# Altium schematic sheet MCU.SchDoc
size A3; Organization: Altium Limited; Address1: L3, 12a Rodborough Rd; Address2: Frenchs Forest; Address3: NSW; Address4: Australia 2086; DocumentNumber: 3; SheetNumber: 3; SheetTotal: 5
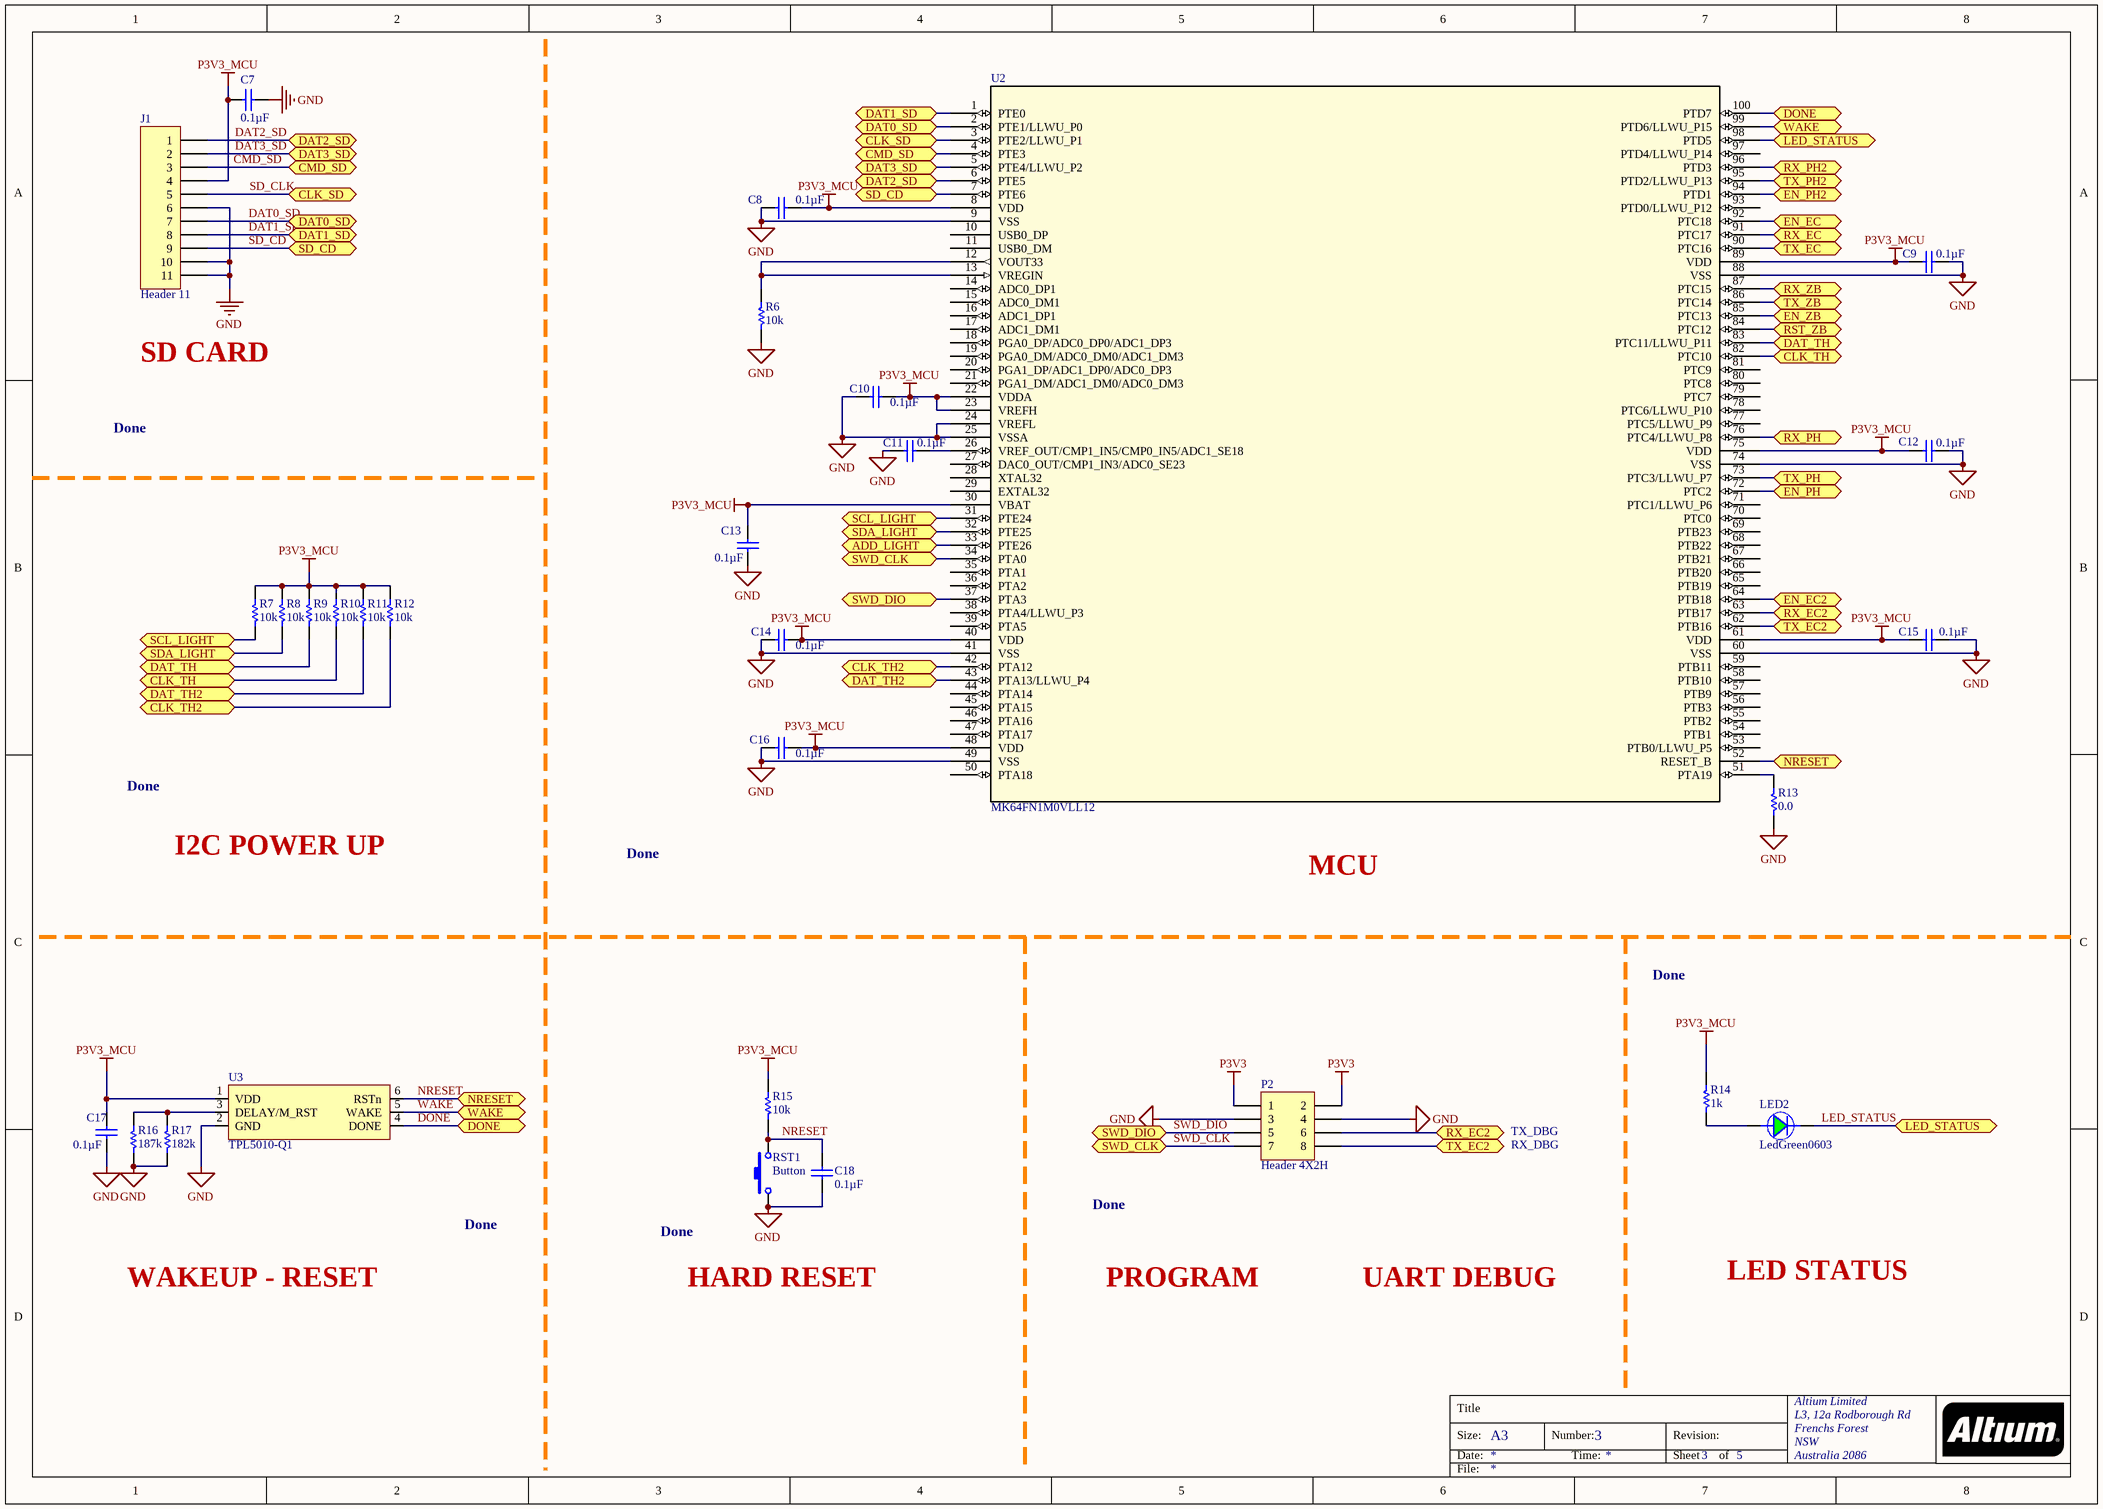
[diagram p0: MCU.SchDoc]

## Parts
C7  0.1µF  [C0402M]
C8  0.1µF  [C0402M]
C9  0.1µF  [C0402M]
C10  0.1µF  [C0402M]
C11  0.1µF  [C0402M]
C12  0.1µF  [C0402M]
C13  0.1µF  [C0402M]
C14  0.1µF  [C0402M]
C15  0.1µF  [C0402M]
C16  0.1µF  [C0402M]
C17  0.1µF  [C0402M]
C18  0.1µF  [C0402M]
J1  Header 11  [TF_V3]
LED2  LedGreen0603  [0603LED-GREEN]
P2  Header 4X2H  [HDR2X4]
R6  10k  [R0603M]
R7  10k  [R0603M]
R8  10k  [R0603M]
R9  10k  [R0603M]
R10  10k  [R0603M]
R11  10k  [R0603M]
R12  10k  [R0603M]
R13  0.0  [R0603M]
R14  1k  [R0603M]
R15  10k  [R0603M]
R16  187k  [R0603M]
R17  182k  [R0603M]
RST1  Button  [SWSMD]
U2  MK64FN1M0VLL12  [LQFP-100_14X14X1]
U3  TPL5010-Q1  [SOT23-6]

## Ports
ADD_LIGHT, CLK_SD, CLK_TH, CLK_TH2, CMD_SD, DAT0_SD, DAT1_SD, DAT2_SD, DAT3_SD, DAT_TH, DAT_TH2, DONE, EN_EC, EN_EC2, EN_PH, EN_PH2, EN_ZB, LED_STATUS, NRESET, RST_ZB, RX_EC, RX_EC2, RX_PH, RX_PH2, RX_ZB, SCL_LIGHT, SD_CD, SDA_LIGHT, SWD_CLK, SWD_DIO, TX_EC, TX_EC2, TX_PH, TX_PH2, TX_ZB, WAKE

## Nets
GND: C7.2 C8.2 C9.2 C10.2 C11.2 C12.2 C13.2 C14.1 C15.2 C16.1 C17.1 C18.1 J1.6 J1.10 J1.11 P2.3 P2.4 R6.1 R13.1 R16.1 R17.1 RST1.1 U2.9(VSS) U2.24(VREFL) U2.25(VSSA) U2.41(VSS) U2.49(VSS) U2.60(VSS) U2.74(VSS) U2.88(VSS) U3.2(GND)
P3V3: P2.1 P2.2
P3V3_MCU: C7.1 C8.1 C9.1 C10.1 C12.1 C13.1 C14.2 C15.1 C16.2 C17.2 J1.4 R7.2 R8.2 R9.2 R10.2 R11.2 R12.2 R14.1 R15.1 U2.8(VDD) U2.22(VDDA) U2.23(VREFH) U2.30(VBAT) U2.40(VDD) U2.48(VDD) U2.61(VDD) U2.75(VDD) U2.89(VDD) U3.1(VDD)
ADD_LIGHT: U2.33(PTE26) ; port ADD_LIGHT
CLK_TH: R10.1 U2.82(PTC10) ; port CLK_TH
CLK_TH2: R12.1 U2.42(PTA12) ; port CLK_TH2
CMD_SD: J1.3 U2.4(PTE3) ; port CMD_SD
DAT0_SD: J1.7 U2.2(PTE1/LLWU_P0) ; port DAT0_SD
DAT1_SD: J1.8 U2.1(PTE0) ; port DAT1_SD
DAT2_SD: J1.1 U2.6(PTE5) ; port DAT2_SD
DAT3_SD: J1.2 U2.5(PTE4/LLWU_P2) ; port DAT3_SD
DAT_TH: R9.1 U2.83(PTC11/LLWU_P11) ; port DAT_TH
DAT_TH2: R11.1 U2.43(PTA13/LLWU_P4) ; port DAT_TH2
DONE: U2.100(PTD7) U3.4(DONE) ; port DONE
EN_EC: U2.92(PTC18) ; port EN_EC
EN_EC2: U2.64(PTB18) ; port EN_EC2
EN_PH: U2.72(PTC2) ; port EN_PH
EN_PH2: U2.94(PTD1) ; port EN_PH2
EN_ZB: U2.85(PTC13) ; port EN_ZB
LED_STATUS: LED2.2(Katot) U2.98(PTD5) ; port LED_STATUS
NRESET: C18.2 R15.2 RST1.2 U2.52(RESET_B) U3.6(RSTn) ; port NRESET
RST_ZB: U2.84(PTC12) ; port RST_ZB
RX_EC: U2.91(PTC17) ; port RX_EC
RX_EC2: P2.6 U2.63(PTB17) ; port RX_EC2
RX_PH: U2.76(PTC4/LLWU_P8) ; port RX_PH
RX_PH2: U2.96(PTD3) ; port RX_PH2
RX_ZB: U2.87(PTC15) ; port RX_ZB
SCL_LIGHT: R7.1 U2.31(PTE24) ; port SCL_LIGHT
SD_CD: J1.9 U2.7(PTE6) ; port SD_CD
SD_CLK: J1.5 U2.3(PTE2/LLWU_P1) ; port CLK_SD
SDA_LIGHT: R8.1 U2.32(PTE25) ; port SDA_LIGHT
SWD_CLK: P2.7 U2.34(PTA0) ; port SWD_CLK
SWD_DIO: P2.5 U2.37(PTA3) ; port SWD_DIO
TX_EC: U2.90(PTC16) ; port TX_EC
TX_EC2: P2.8 U2.62(PTB16) ; port TX_EC2
TX_PH: U2.73(PTC3/LLWU_P7) ; port TX_PH
TX_PH2: U2.95(PTD2/LLWU_P13) ; port TX_PH2
TX_ZB: U2.86(PTC14) ; port TX_ZB
WAKE: U2.99(PTD6/LLWU_P15) U3.5(WAKE) ; port WAKE
NetC11_1: C11.1 U2.26(VREF_OUT/CMP1_IN5/CMP0_IN5/ADC1_SE18)
NetLED2_1: LED2.1(anot) R14.2
NetR6_2: R6.2 U2.12(VOUT33) U2.13(VREGIN)
NetR13_2: R13.2 U2.51(PTA19)
NetR16_2: R16.2 R17.2 U3.3(DELAY/M_RST)

Not connected (* = marked no-connect by the designer): U2 10(USB0_DP) 11(USB0_DM) 14(ADC0_DP1) 15(ADC0_DM1) 16(ADC1_DP1) 17(ADC1_DM1) 18(PGA0_DP/ADC0_DP0/ADC1_DP3) 19(PGA0_DM/ADC0_DM0/ADC1_DM3) 20(PGA1_DP/ADC1_DP0/ADC0_DP3) 21(PGA1_DM/ADC1_DM0/ADC0_DM3) 27(DAC0_OUT/CMP1_IN3/ADC0_SE23) 28(XTAL32) 29(EXTAL32) 35(PTA1) 36(PTA2) 38(PTA4/LLWU_P3) 39(PTA5) 44(PTA14) 45(PTA15) 46(PTA16) 47(PTA17) 50(PTA18) 53(PTB0/LLWU_P5) 54(PTB1) 55(PTB2) 56(PTB3) 57(PTB9) 58(PTB10) 59(PTB11) 65(PTB19) 66(PTB20) 67(PTB21) 68(PTB22) 69(PTB23) 70(PTC0) 71(PTC1/LLWU_P6) 77(PTC5/LLWU_P9) 78(PTC6/LLWU_P10) 79(PTC7) 80(PTC8) 81(PTC9) 93(PTD0/LLWU_P12) 97(PTD4/LLWU_P14)

## Notes on the sheet
- SD CARD
- Done
- I2C POWER UP
- MCU
- TX_DBG
- RX_DBG
- WAKEUP - RESET
- HARD RESET
- PROGRAM
- UART DEBUG
- LED STATUS
- Title
- Size:
- Date:
- A3
- Number:
- Time:
- Revision:
- Sheet
- of
- File:

## Library data of the parts
C7-C18 = CAP0.1u0402: CAP CER 0.1UF 10V X7R 0402; Manufacturer: Taiyo Yuden; Manufacturer Part Number: LMK105B7104KVHF; Tolerance: ±10%; Supplier 1: Digi-Key; RoHS: RoHS Compliant; Category: Capacitors; Stock 1: 23930; Pricing 1: 1=0.1, 10=0.05, 100=0.0223, 500=0.01594, 1000=0.01252, 2500=0.01138, 5000=0.01047 (USD); Packaging: Cut Tape (CT); Part Status: Active; Capacitance: 0.1µF; Voltage - Rated: 10V; Temperature Coefficient: X7R; Operating Temperature: -55°C ~ 125°C; Features: -; Ratings: AEC-Q200; Applications: Automotive; Mounting Type: Surface Mount, MLCC; Package / Case: 0402 (1005 Metric); Size / Dimension: 0.039" L x 0.020" W (1.00mm x 0.50mm); Height - Seated (Max): -; Thickness (Max): 0.022" (0.55mm); Lead Spacing: -; Lead Style: -; ComponentLink1URL: http://www.yuden.co.jp/productdata/catalog/en/mlcc_all_hq_e.pdf; ComponentLink1Description: http://www.yuden.co.jp/productdata/catalog/en/mlcc_all_hq_e.pdf; Supplier Part Number 1: 587-3769-1-ND
J1 = Header 11: Header, 11-Pin; Module: Micro-SD; LatestRevisionDate: 17-Jul-2002; LatestRevisionNote: Re-released for DXP Platform.; Publisher: Altium Limited
LED2 = LedGreen0603: LED GREEN CLEAR 0603 SMD; Manufacturer: Everlight Electronics Co Ltd; Manufacturer Part Number: QTLP601C4TR; Lens Color: Colorless; Millicandela Rating: 15mcd; Lens Style/Size: Rectangle with Flat Top, 1.20mm x 0.80mm; Voltage - Forward (Vf) (Typ): 2.1V; Current - Test: 20mA; Viewing Angle: 120°; Wavelength - Dominant: 570nm; Wavelength - Peak: 565nm; Supplier 1: Digi-Key; RoHS: RoHS Compliant; Category: Optoelectronics; Stock 1: 19080; Pricing 1: 1=0.51, 10=0.366, 25=0.2808, 100=0.1832, 250=0.13432, 500=0.11396, 1000=0.09361 (USD); Packaging: Cut Tape (CT); Part Status: Active; Color: Green; Lens Transparency: Clear; Mounting Type: Surface Mount; Features: -; Package / Case: 0603 (1608 Metric); Supplier Device Package: 0603; Size / Dimension: 1.60mm L x 0.80mm W; Height (Max): 0.60mm; ComponentLink1URL: http://media.digikey.com/pdf/Data%20Sheets/Everlight%20PDFs/QTLP601C-2,3,4,7,B.pdf; ComponentLink1Description: http://media.digikey.com/pdf/Data%20Sheets/Everlight%20PDFs/QTLP601C-2,3,4,7,B.pdf; Supplier Part Number 1: 1080-1405-1-ND
P2 = Header 4X2H: Header, 4-Pin, Dual row, Right Angle; LatestRevisionDate: 17-Jul-2002; LatestRevisionNote: Re-released for DXP Platform.; Publisher: Altium Limited
R6-R12 R15 = RES10k0603: RES SMD 10K OHM 1% 1/10W 0603; Manufacturer: Panasonic Electronic Components; Manufacturer Part Number: ERJ-3EKF1002V; Power (Watts): 0.1W, 1/10W; Temperature Coefficient: ±100ppm/°C; Supplier 1: Digi-Key; RoHS: RoHS Compliant; Category: Resistors; Stock 1: 0; Pricing 1: 1=0.1, 10=0.021, 100=0.0087, 1000=0.00389, 2500=0.00338 (USD); Packaging: Digi-Reel®; Part Status: Active; Resistance (Ohms): 10k; Tolerance: ±1%; Composition: Thick Film; Features: Automotive AEC-Q200; Operating Temperature: -55°C ~ 155°C; Package / Case: 0603 (1608 Metric); Supplier Device Package: 0603; Size / Dimension: 0.063" L x 0.031" W (1.60mm x 0.80mm); Height - Seated (Max): 0.022" (0.55mm); Failure Rate: -; ComponentLink1URL: https://industrial.panasonic.com/cdbs/www-data/pdf/RDA0000/AOA0000C298.pdf; ComponentLink1Description: https://industrial.panasonic.com/cdbs/www-data/pdf/RDA0000/AOA0000C298.pdf; Supplier Part Number 1: P10.0KHDKR-ND
R13 = RES00603: RES SMD 0.0OHM JUMPER 1/10W 0603; Manufacturer: Panasonic Electronic Components; Manufacturer Part Number: ERJ-3GEY0R00V; Power (Watts): 0.1W, 1/10W; Supplier 1: Digi-Key; RoHS: RoHS Compliant; Category: Resistors; Stock 1: 8597757; Pricing 1: 1=0.1, 10=0.016, 25=0.0116, 50=0.0088, 100=0.0065, 250=0.00496, 500=0.00396, 1000=0.00292 (USD); Packaging: Cut Tape (CT); Part Status: Active; Resistance (Ohms): 0.0; Tolerance: Jumper; Composition: Thick Film; Features: Automotive AEC-Q200; Temperature Coefficient: -; Operating Temperature: -55°C ~ 155°C; Package / Case: 0603 (1608 Metric); Supplier Device Package: 0603; Size / Dimension: 0.063" L x 0.031" W (1.60mm x 0.80mm); Height - Seated (Max): 0.022" (0.55mm); Failure Rate: -; ComponentLink1URL: http://industrial.panasonic.com/www-cgi/jvcr13pz.cgi?E+PZ+3+AOA0001+ERJ3GEY0R00V+7+WW; ComponentLink1Description: http://industrial.panasonic.com/www-cgi/jvcr13pz.cgi?E+PZ+3+AOA0001+ERJ3GEY0R00V+7+WW; Supplier Part Number 1: P0.0GCT-ND
R14 = RES1k0603: RES SMD 1K OHM 1% 1/10W 0603; Manufacturer: Panasonic Electronic Components; Manufacturer Part Number: ERJ-3EKF1001V; Power (Watts): 0.1W, 1/10W; Temperature Coefficient: ±100ppm/°C; Supplier 1: Digi-Key; RoHS: RoHS Compliant; Category: Resistors; Stock 1: 0; Pricing 1: 1=0.1, 10=0.021, 100=0.0087, 1000=0.00389, 2500=0.00338 (USD); Packaging: Digi-Reel®; Part Status: Active; Resistance (Ohms): 1k; Tolerance: ±1%; Composition: Thick Film; Features: Automotive AEC-Q200; Operating Temperature: -55°C ~ 155°C; Package / Case: 0603 (1608 Metric); Supplier Device Package: 0603; Size / Dimension: 0.063" L x 0.031" W (1.60mm x 0.80mm); Height - Seated (Max): 0.022" (0.55mm); Failure Rate: -; ComponentLink1URL: https://industrial.panasonic.com/cdbs/www-data/pdf/RDA0000/AOA0000C298.pdf; ComponentLink1Description: https://industrial.panasonic.com/cdbs/www-data/pdf/RDA0000/AOA0000C298.pdf; Supplier Part Number 1: P1.00KHDKR-ND
R16 = Resistor: RES SMD 187K OHM 1% 1/10W 0603; Manufacturer: Panasonic Electronic Components; Manufacturer Part Number: ERJ-3EKF1873V; Power (Watts): 0.1W, 1/10W; Temperature Coefficient: ±100ppm/°C; Supplier 1: Digi-Key; Supplier Part Number 1: P187KHCT-ND; RoHS: RoHS Compliant; Category: Resistors; Stock 1: 17711; Pricing 1: 1=0.1, 10=0.021, 100=0.0087, 1000=0.00389, 2500=0.00338 (USD); Packaging: Cut Tape (CT); Part Status: Active; Resistance (Ohms): 187k; Tolerance: ±1%; Composition: Thick Film; Features: Automotive AEC-Q200; Operating Temperature: -55°C ~ 155°C; Package / Case: 0603 (1608 Metric); Supplier Device Package: 0603; Size / Dimension: 0.063" L x 0.031" W (1.60mm x 0.80mm); Height - Seated (Max): 0.022" (0.55mm); Failure Rate: -; ComponentLink1URL: https://industrial.panasonic.com/cdbs/www-data/pdf/RDA0000/AOA0000C298.pdf; ComponentLink1Description: https://industrial.panasonic.com/cdbs/www-data/pdf/RDA0000/AOA0000C298.pdf
R17 = Resistor: RES SMD 182K OHM 1% 1/10W 0603; Manufacturer: Panasonic Electronic Components; Manufacturer Part Number: ERJ-3EKF1823V; Power (Watts): 0.1W, 1/10W; Temperature Coefficient: ±100ppm/°C; Supplier 1: Digi-Key; Supplier Part Number 1: P182KHCT-ND; RoHS: RoHS Compliant; Category: Resistors; Stock 1: 140068; Pricing 1: 1=0.1, 10=0.021, 100=0.0087, 1000=0.00389, 2500=0.00338 (USD); Packaging: Cut Tape (CT); Part Status: Active; Resistance (Ohms): 182k; Tolerance: ±1%; Composition: Thick Film; Features: Automotive AEC-Q200; Operating Temperature: -55°C ~ 155°C; Package / Case: 0603 (1608 Metric); Supplier Device Package: 0603; Size / Dimension: 0.063" L x 0.031" W (1.60mm x 0.80mm); Height - Seated (Max): 0.022" (0.55mm); Failure Rate: -; ComponentLink1URL: https://industrial.panasonic.com/cdbs/www-data/pdf/RDA0000/AOA0000C298.pdf; ComponentLink1Description: https://industrial.panasonic.com/cdbs/www-data/pdf/RDA0000/AOA0000C298.pdf
U2 = MK64FN1M0VLL12: IC MCU 32BIT 1MB FLASH 100LQFP; Manufacturer: NXP USA Inc.; Core Processor: ARM® Cortex®-M4; Core Size: 32-Bit; Speed: 120MHz; Connectivity: CAN, EBI/EMI, Ethernet, I²C, IrDA, SD, SPI, UART/USART, USB, USB OTG; Peripherals: DMA, I²S, LVD, POR, PWM, WDT; Number of I/O: 66; Program Memory Size: 1MB (1M x 8); RAM Size: 256K x 8; Voltage - Supply (Vcc/Vdd): 1.71 V ~ 3.6 V; Data Converters: A/D 32x16b, D/A 1x12b; Oscillator Type: Internal; Supplier 1: Digi-Key; Manufacturer Part Number: MK64FN1M0VLL12; RoHS: RoHS Compliant; Category: Integrated Circuits (ICs); Stock 1: 0; Pricing 1: 1=13, 10=11.947, 100=10.7003 (USD); Packaging: Tray; Part Status: Active; Program Memory Type: FLASH; EEPROM Size: -; Operating Temperature: -40°C ~ 105°C (TA); Package / Case: 100-LQFP; Supplier Device Package: 100-LQFP (14x14); ComponentLink1URL: http://cache.freescale.com/files/microcontrollers/doc/data_sheet/K64P144M120SF5.pdf; ComponentLink1Description: http://cache.freescale.com/files/microcontrollers/doc/data_sheet/K64P144M120SF5.pdf; Supplier Part Number 1: MK64FN1M0VLL12-ND
U3 = TPL5010: IC TIMER W/WATCHDOG 6SOT; Manufacturer: Texas Instruments; Manufacturer Part Number: TPL5010QDDCRQ1; Voltage - Supply: 1.8 V ~ 5 V; Current - Supply: 35nA; Supplier 1: Digi-Key; RoHS: RoHS Compliant; Category: Integrated Circuits (ICs); Stock 1: 2785; Pricing 1: 1=1.27, 10=1.136, 100=0.886, 500=0.73192, 1000=0.57783 (USD); Packaging: Cut Tape (CT); Part Status: Active; Type: Programmable Timer; Count: -; Frequency: -; Operating Temperature: -40°C ~ 125°C; Package / Case: SOT-23-6 Thin, TSOT-23-6; Supplier Device Package: TSOT-23-6; Mounting Type: Surface Mount; ComponentLink1URL: http://www.ti.com/lit/ds/symlink/tpl5010-q1.pdf; ComponentLink1Description: http://www.ti.com/lit/ds/symlink/tpl5010-q1.pdf; Supplier Part Number 1: 296-44963-1-ND